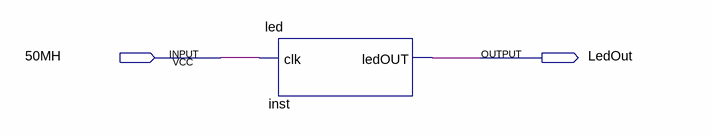
[diagram p0: schematic sheet]
// Quartus schematic Diagrams_1.bdf as structural Verilog: 1 symbols, 2 pins
module Diagrams_1 (
  input  \50MH ,
  output LedOut
);

  led inst (.clk(\50MH ), .ledOUT(LedOut));
endmodule
